# Altium schematic sheet SDCARD_MRAM.SchDoc
size 420 x 297 mm; SheetNumber: 13; SheetTotal: 34
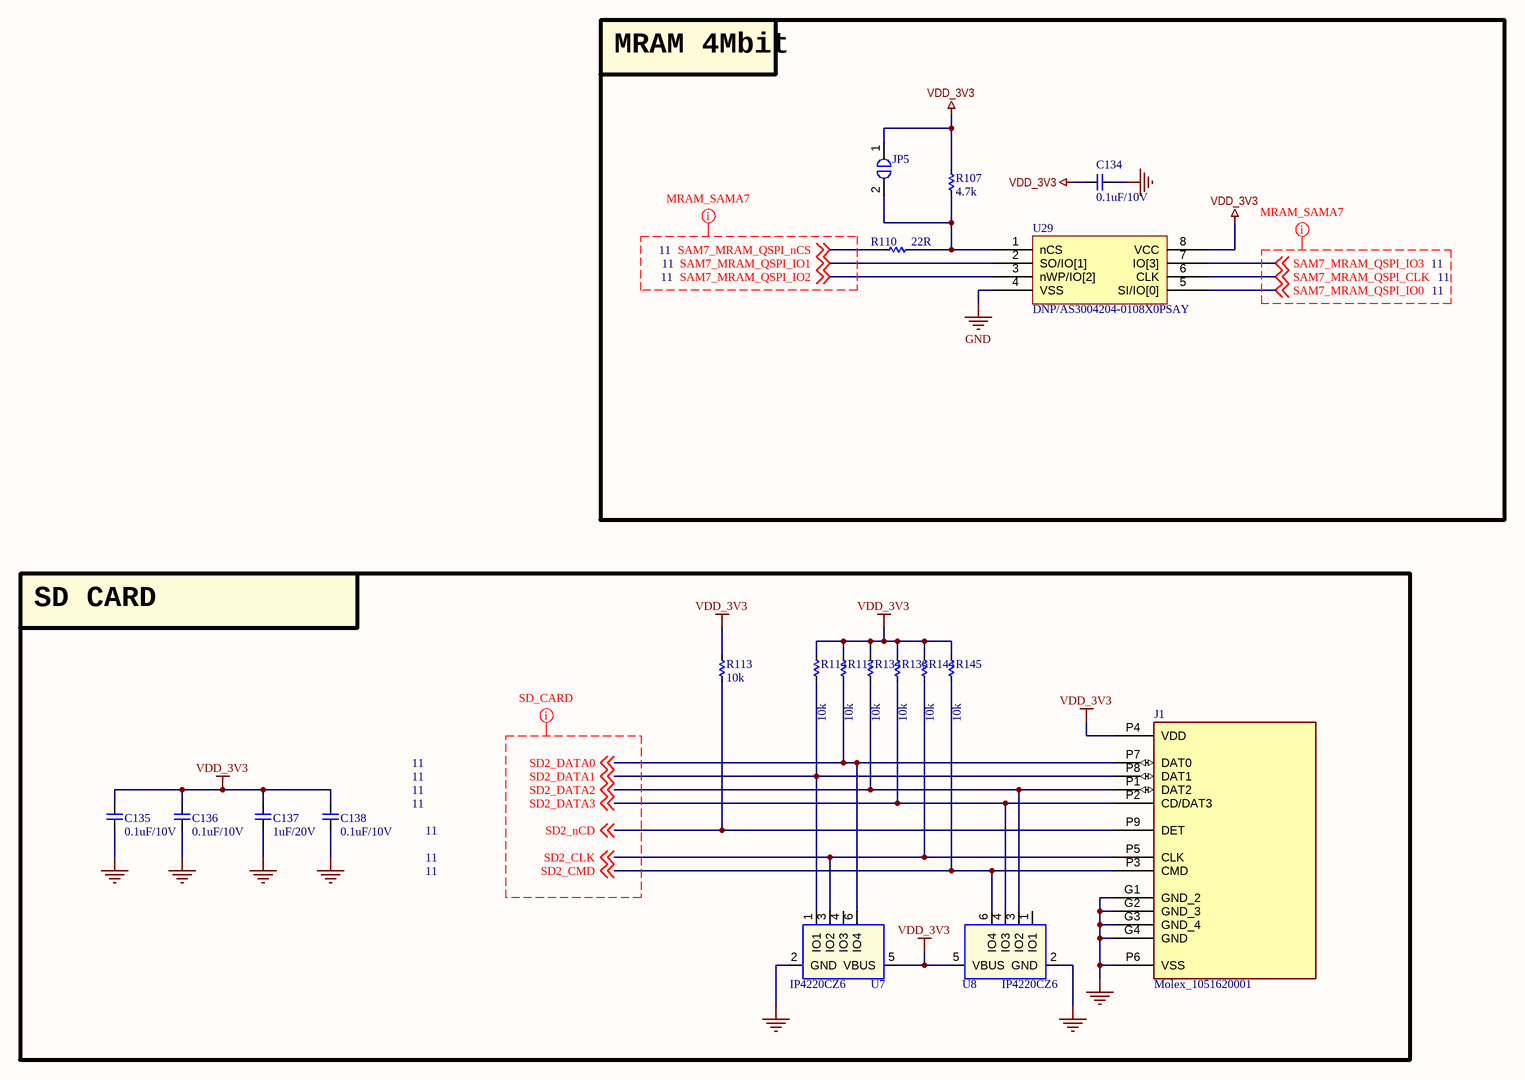
[diagram p0: SDCARD_MRAM.SchDoc]

## Parts
C134  0.1uF/10V  [CAP_C_1005X50_L]
C135  0.1uF/10V  [CAP_C_1005X50_L]
C136  0.1uF/10V  [CAP_C_1005X50_L]
C137  1uF/20V  [CAP_C_1005X50_L]
C138  0.1uF/10V  [CAP_C_1005X50_L]
J1  Molex_1051620001  [Molex_1051620001]
JP5  (no value)  [JUMPER_1608]
R107  4.7k  [RES_C_1005x30_L]
R110  22R  [RES_C_1005x30_L]
R113  10k  [RES_C_1005x30_L]
R114  10k  [RES_C_1005x30_L]
R117  10k  [RES_C_1005x30_L]
R134  10k  [RES_C_1005x30_L]
R136  10k  [RES_C_1005x30_L]
R144  10k  [RES_C_1005x30_L]
R145  10k  [RES_C_1005x30_L]
U7  IP4220CZ6  [SOT95P280X145-6N]
U8  IP4220CZ6  [SOT95P280X145-6N]
U29  DNP/AS3004204-0108X0PSAY  [SOIC127P790X216-8]

## Blocks framed on the sheet
MRAM 4Mbit: C134 JP5 R107 R110 U29
SD CARD: C135-C138 J1 R113 R114 R117 R134 R136 R144 R145 U7 U8

## Nets
GND: C134.1 C135.1 C136.1 C137.1 C138.1 J1.G1(GND_2) J1.G2(GND_3) J1.G3(GND_4) J1.G4(GND) J1.P6(VSS) U7.2(GND) U8.2(GND) U29.4(VSS)
VDD_3V3: C134.2 C135.2 C136.2 C137.2 C138.2 J1.P4(VDD) JP5.1 R107.2 R113.2 R114.2 R117.2 R134.2 R136.2 R144.2 R145.2 U7.5(VBUS) U8.5(VBUS) U29.8(VCC)
SAM7_MRAM_QSPI_CLK: U29.6(CLK) ; off-sheet SAM7_MRAM_QSPI_CLK
SAM7_MRAM_QSPI_IO0: U29.5(SI/IO[0]) ; off-sheet SAM7_MRAM_QSPI_IO0
SAM7_MRAM_QSPI_IO1: U29.2(SO/IO[1]) ; off-sheet SAM7_MRAM_QSPI_IO1
SAM7_MRAM_QSPI_IO2: U29.3(nWP/IO[2]) ; off-sheet SAM7_MRAM_QSPI_IO2
SAM7_MRAM_QSPI_IO3: U29.7(IO[3]) ; off-sheet SAM7_MRAM_QSPI_IO3
SAM7_MRAM_QSPI_nCS: R110.1 ; off-sheet SAM7_MRAM_QSPI_nCS
SD2_CLK: J1.P5(CLK) R144.1 U7.3(IO2) ; off-sheet SD2_CLK
SD2_CMD: J1.P3(CMD) R145.1 U8.6(IO4) ; off-sheet SD2_CMD
SD2_DATA0: J1.P7(DAT0) R117.1 U7.6(IO4) ; off-sheet SD2_DATA0
SD2_DATA1: J1.P8(DAT1) R114.1 U7.1(IO1) ; off-sheet SD2_DATA1
SD2_DATA2: J1.P1(DAT2) R134.1 U8.3(IO2) ; off-sheet SD2_DATA2
SD2_DATA3: J1.P2(CD/DAT3) R136.1 U8.4(IO3) ; off-sheet SD2_DATA3
SD2_nCD: J1.P9(DET) R113.1 ; off-sheet SD2_nCD
NetJP5_2: JP5.2 R107.1 R110.2 U29.1(nCS)

Not connected (* = marked no-connect by the designer): U7 4(IO3); U8 1(IO1)

## Layout directives
net class MRAM_SAMA7: SAM7_MRAM_QSPI_CLK, SAM7_MRAM_QSPI_IO0, SAM7_MRAM_QSPI_IO1, SAM7_MRAM_QSPI_IO2, SAM7_MRAM_QSPI_IO3, SAM7_MRAM_QSPI_nCS
net class SD_CARD: SD2_CLK, SD2_CMD, SD2_DATA0, SD2_DATA1, SD2_DATA2, SD2_DATA3, SD2_nCD

## Notes on the sheet
- Project:
- Sub-system:
- Design by:
- Sheet title:
- Sheet
- of
- Checked by:
- Approved by:
- Revision:
- Document No:
- Size:
- Date:
- A3

## Library data of the parts
C134-C136 C138 = _CAP_C_2: CAP
C137 = _CAP_C_2: CAP CHIP
J1 = Molex_1051620001: 9 (8 + 1) Position Card Connector Secure Digital - microSDâ„¢ Surface Mount, Right Angle Gold; MF: Molex; SnapEDA_Link: https://www.snapeda.com/parts/1051620001/Molex/view-part/?ref=snap; Package: None; Value: *; MP: 1051620001; Check_prices: https://www.snapeda.com/parts/1051620001/Molex/view-part/?ref=eda
JP5 = JUMPER_1_1
R107 R110 R113 R114 R117 R134 R136 R144 R145 = _RES_B_2: RES
U7 U8 = IP4220CZ6_0: P/N: 132D42200S; PCB Footprint: SOT23-6L; CLABCONF0: =SB-UCMIMX93
U29 = IC_RAM_AS3004204-0108X0PSAY